# EAGLE design TrinketBlinkM0N (EAGLE 8.4.3)
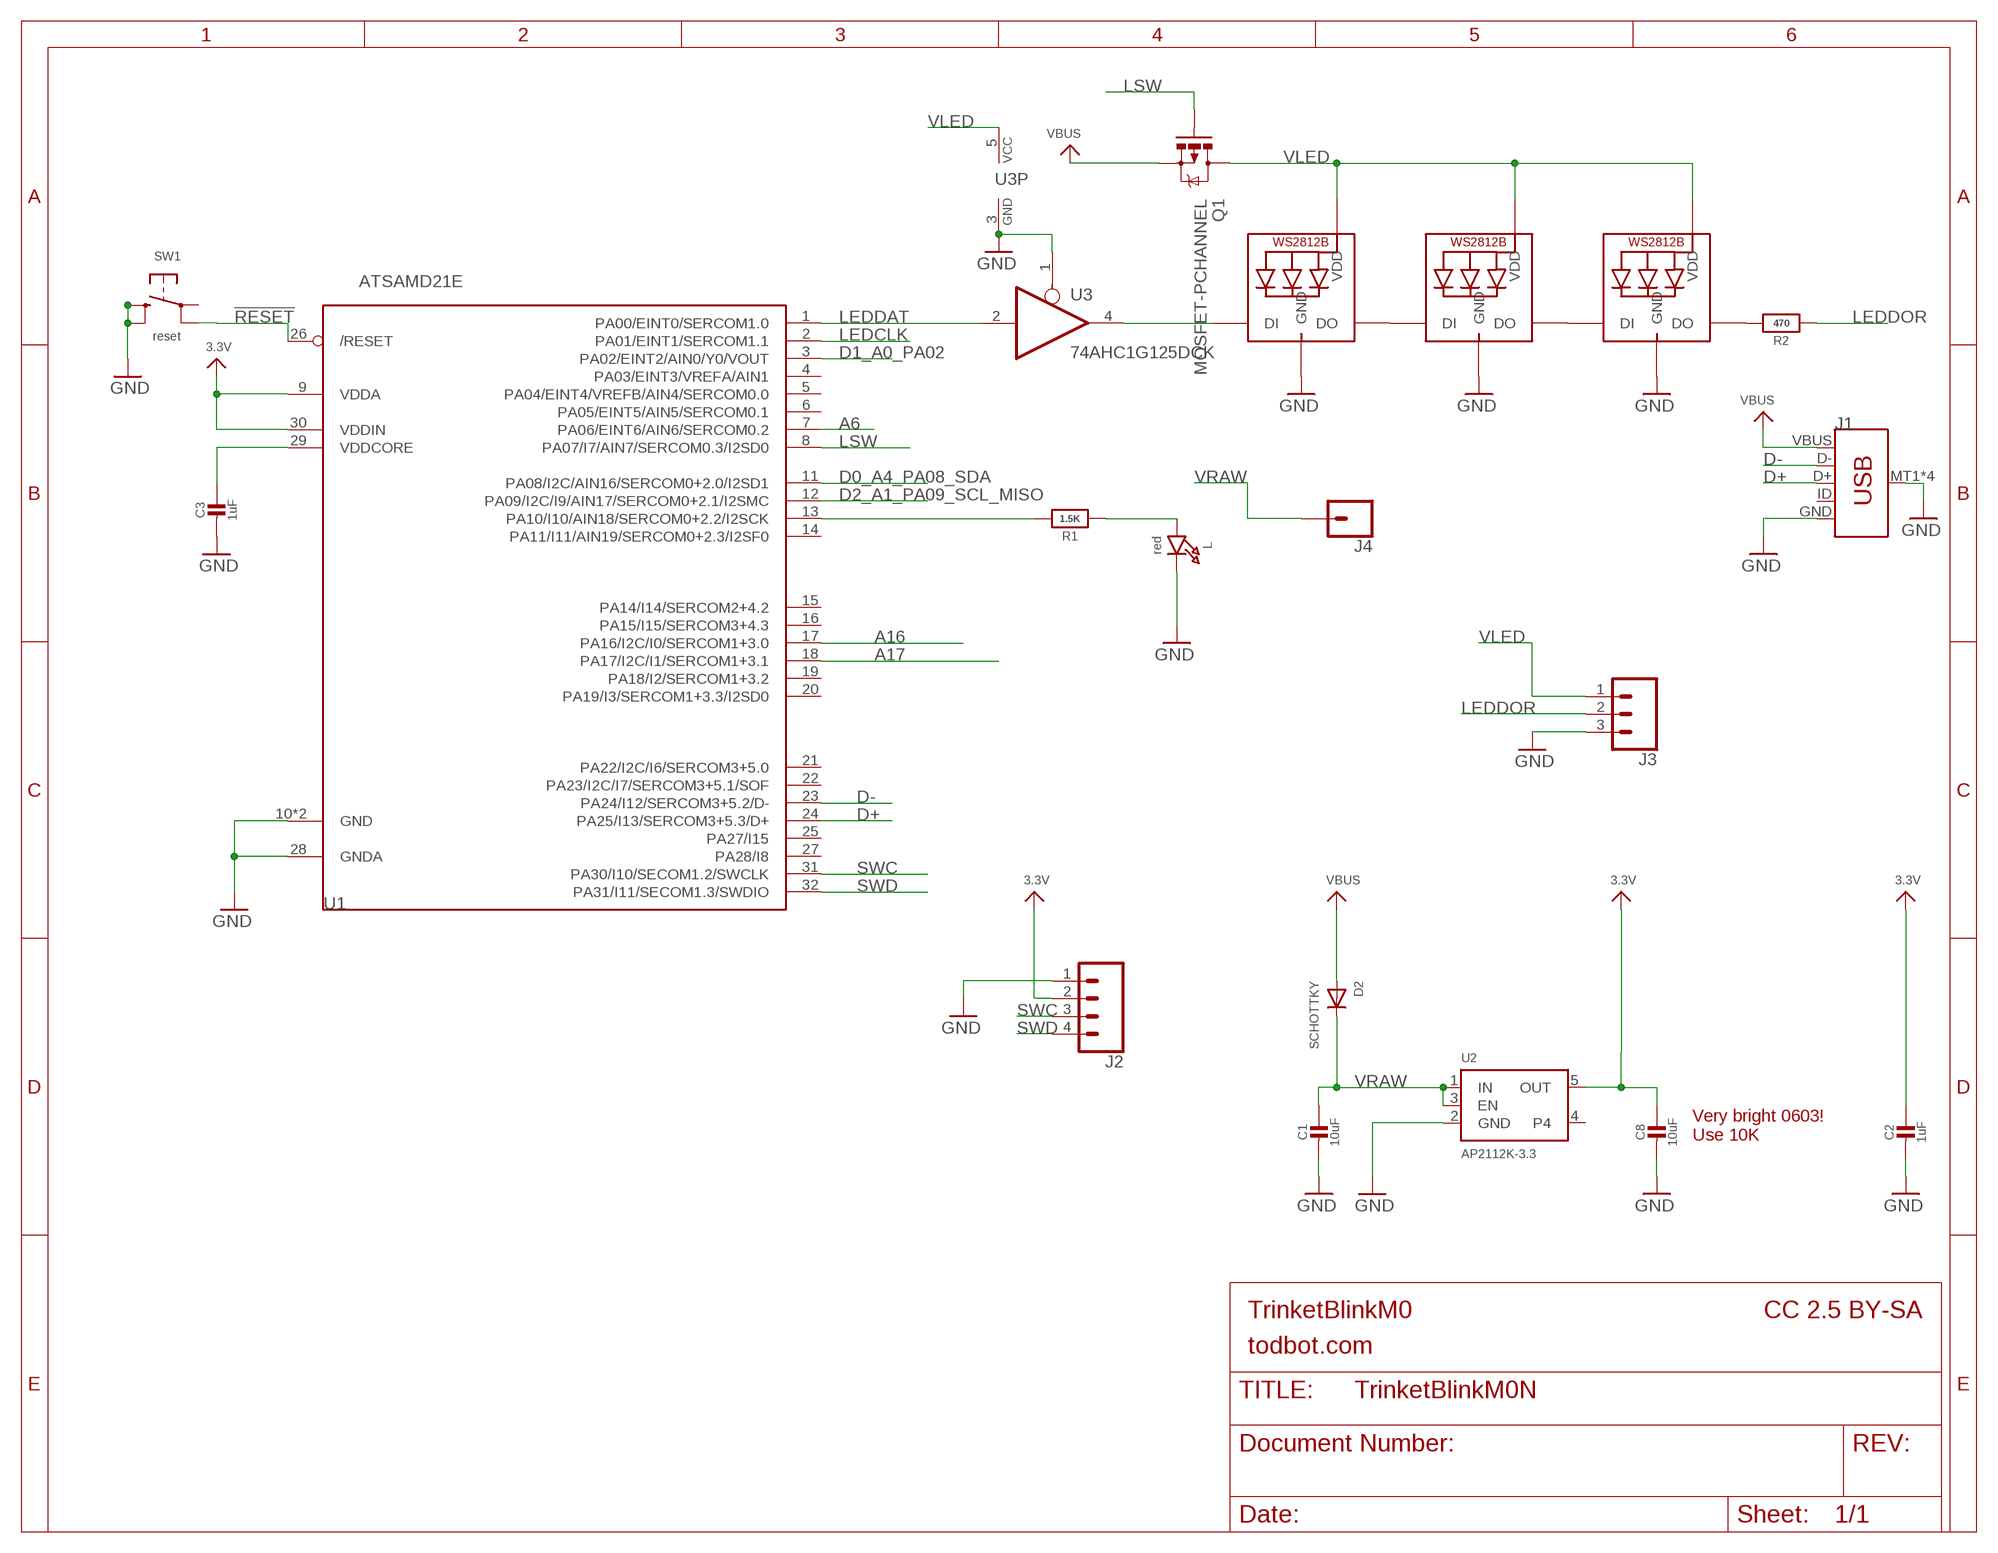
[diagram p0: schematic, sheet 1]

## Parts
C1  10uF  CAP_CERAMIC0805-NOOUTLINE  [0805-NO]
C2  1uF  CAP_CERAMIC0603_NO  [0603-NO]
C3  1uF  CAP_CERAMIC0603_NO  [0603-NO]
C8  10uF  CAP_CERAMIC0805-NOOUTLINE  [0805-NO]
D2  SCHOTTKY  DIODE_SOD-123FL  [SOD-123FL]
J1  USB_MICRO-B_SMT  [USB-MICROB]
J2  CONN_04  [1X04]
J3  CONN_03  [1X03]
J4  CONN_01  [1X01]
L  red  LED0603_NOOUTLINE  [CHIPLED_0603_NOOUTLINE]
LED1  WS2812B3535  [LED3535]
LED2  WS2812B3535  [LED3535]
LED3  WS2812B3535  [LED3535]
Q1  MOSFET-PCHANNEL  [SOT23-3]
R1  1.5K  RESISTOR_0603_NOOUT  [0603-NO]
R2  470  RESISTOR_0603_NOOUT  [0603-NO]
SW1  reset  SWITCH_TACT_SMT4.6X2.8  [BTN_KMR2_4.6X2.8]
U1  ATSAMD21E  [QFN32_5MM]
U2  AP2112K-3.3  VREG_SOT23-5  [SOT23-5]
U3  74AHC1G125DCK  [SC70-5]

## Nets
3.3V: C2.1 C8.1 J2.2 U1.9(VDDA) U1.30(VDDIN) U2.5(OUT)
!RESET: SW1.A'(P1) U1.26(/RESET)
A6: U1.7(PA06/EINT6/AIN6/SERCOM0.2)
A16: U1.17(PA16/I2C/I0/SERCOM1+3.0)
A17: U1.18(PA17/I2C/I1/SERCOM1+3.1)
D0_A4_PA08_SDA: U1.11(PA08/I2C/AIN16/SERCOM0+2.0/I2SD1)
D1_A0_PA02: U1.3(PA02/EINT2/AIN0/Y0/VOUT)
D2_A1_PA09_SCL_MISO: U1.12(PA09/I2C/I9/AIN17/SERCOM0+2.1/I2SMC)
D+: J1.D+ U1.24(PA25/I13/SERCOM3+5.3/D+)
D-: J1.D- U1.23(PA24/I12/SERCOM3+5.2/D-)
GND: C1.2 C2.2 C3.2 C8.2 J1.GND J1.MT1(SHIELD) J1.MT2(SHIELD) J1.P$1(SHIELD) J1.P$2(SHIELD) J2.1 J3.3 L.C LED1.4(GND) LED2.4(GND) LED3.4(GND) SW1.B'(S1) SW1.B(S) U1.10(GND) U1.28(GNDA) U1.33(GND) U2.2(GND) U3.1(OE) U3.3(GND)
LEDCLK: U1.2(PA01/EINT1/SERCOM1.1)
LEDDAT: U1.1(PA00/EINT0/SERCOM1.0) U3.2(I)
LEDDATO: LED1.1(DI) U3.4(O)
LEDDOR: J3.2 R2.1
LSW: Q1.1(G) U1.8(PA07/I7/AIN7/SERCOM0.3/I2SD0)
N$1: L.A R1.1
N$2: R1.2 U1.13(PA10/I10/AIN18/SERCOM0+2.2/I2SCK)
N$4: LED1.3(DO) LED2.1(DI)
N$5: LED2.3(DO) LED3.1(DI)
N$6: LED3.3(DO) R2.2
SWC: J2.3 U1.31(PA30/I10/SECOM1.2/SWCLK)
SWD: J2.4 U1.32(PA31/I11/SECOM1.3/SWDIO)
VBUS: D2.A J1.VBUS Q1.2(S)
VDDCORE: C3.1 U1.29(VDDCORE)
VLED: J3.1 LED1.2(VDD) LED2.2(VDD) LED3.2(VDD) Q1.3(D) U3.5(VCC)
VRAW: C1.1 D2.C J4.1 U2.1(IN) U2.3(EN)
Unconnected: J1.ID SW1.A(P) U1.4(PA03/EINT3/VREFA/AIN1) U1.5(PA04/EINT4/VREFB/AIN4/SERCOM0.0) U1.6(PA05/EINT5/AIN5/SERCOM0.1) U1.14(PA11/I11/AIN19/SERCOM0+2.3/I2SF0) U1.15(PA14/I14/SERCOM2+4.2) U1.16(PA15/I15/SERCOM3+4.3) U1.19(PA18/I2/SERCOM1+3.2) U1.20(PA19/I3/SERCOM1+3.3/I2SD0) U1.21(PA22/I2C/I6/SERCOM3+5.0) U1.22(PA23/I2C/I7/SERCOM3+5.1/SOF) U1.25(PA27/I15) U1.27(PA28/I8) U2.4

## Notes on the sheet
- Very bright 0603!
  Use 10K
- TrinketBlinkM0 | CC 2.5 BY-SA
- todbot.com

## Library data of the parts
C1-C3 C8 = microbuilder:CAP_CERAMIC: Ceramic Capacitors For new designs, use the packages preceded by an '_' character since they are more reliable: The following footprints should be used on most boards: _0402 - Standard footprint for regular board layouts _0603 - Standard footprint for regular board layouts _0805 - Standard footprint for regular board layouts _1206 - Standard footprint for regular board layouts For extremely tight-pitch boards where space is at a premium, the following 'micro-pitch' footprints can be used (smaller pads, no silkscreen outline, etc.): _0402MP - Micro-pitch footprint for very dense/compact boards _0603MP - Micro-pitch footprint for very dense/compact boards _0805MP - Micro-pitch footprint for very dense/compact boards _1206MP - Micro-pitch footprint for very dense/compact boards
D2 = adafruit:DIODE: Diode SMADIODE - SMA Surface Mount Package 20V 1A Schottky Diode Digikey: 641-1014-6-ND DO-1N4148 - Through Hole Small Current Diode SOD-123 20V 1 A (.5mV Vf) Schottky Diode - Digikey: MBRX120TPMSCT-ND SOD-323 10V 570mA (.38mV Vf, 3ns) Schottky Diode - Digikey: ZLLS410CT-ND SOD-523 30V 30mA Schottky Diode (RB751S-40TE61) - Digikey: RB751S-40TE61CT-ND SOT23-R/W - SOT23 Package (R = Solder Paste/Reflow Ovens, W = Hand-Soldering) BAT54Film 40V 300mA - Digikey: 497-7162-1-ND
J1 = SparkFun-Connectors:USB_MICRO-B: USB Type Micro-B Connector Male/female and PTH/SMT variants SparkFun Products: SparkFun microB USB Breakout <https://www.sparkfun.com/products/12035> SparkFun USB microB Plug Breakout <https://www.sparkfun.com/products/10031> SparkFun ESP8266 Thing <https://www.sparkfun.com/products/13231>; PROD_ID: CONN-09505; SF_ID: PRT-08533
J2 = SparkFun-Connectors:CONN_04: Multi connection point. Often used as Generic Header-pin footprint for 0.1 inch spaced/style header connections On any of the 0.1 inch spaced packages, you can populate with these: Break Away Headers - Straight <https://www.sparkfun.com/products/116> (PRT-00116) Break Away Male Headers - Right Angle <https://www.sparkfun.com/products/553> (PRT-00553) Female Headers <https://www.sparkfun.com/products/115> (PRT-00115) Break Away Headers - Machine Pin <https://www.sparkfun.com/products/117> (PRT-00117) Break Away Female Headers - Swiss Machine Pin <https://www.sparkfun.com/products/743> (PRT-00743) For SCREWTERMINALS and SPRING TERMINALS visit here: Screw Terimnals on SparkFun.com <https://www.sparkfun.com/search/results?term=Screw+Terminals> (5mm/3.5mm/2.54mm spacing) This device is also useful as a general connection point to wire up your design to another part of your project. Our various solder wires solder well into these plated through hole pads. Hook-Up Wire - Assortment (Stranded, 22 AWG) <https://www.sparkfun.com/products/11375> (PRT-11375) Hook-Up Wire - Assortment (Solid Core, 22 AWG) <https://www.sparkfun.com/products/11367> (PRT-11367) View the entire wire category on our website here <https://www.sparkfun.com/categories/141> Special notes: Molex polarized connector foot print use with SKU : PRT-08231 with associated crimp pins and housings. 1MM SMD Version SKU: PRT-10208; PROD_ID: CONN-09696
J3 = SparkFun-Connectors:CONN_03: Multi connection point. Often used as Generic Header-pin footprint for 0.1 inch spaced/style header connections On any of the 0.1 inch spaced packages, you can populate with these: Break Away Headers - Straight <https://www.sparkfun.com/products/116> (PRT-00116) Break Away Male Headers - Right Angle <https://www.sparkfun.com/products/553> (PRT-00553) Female Headers <https://www.sparkfun.com/products/115> (PRT-00115) Break Away Headers - Machine Pin <https://www.sparkfun.com/products/117> (PRT-00117) Break Away Female Headers - Swiss Machine Pin <https://www.sparkfun.com/products/743> (PRT-00743) Stackable Header - 3 Pin (Female, 0.1") <https://www.sparkfun.com/products/13875> (PRT-13875) For SCREWTERMINALS and SPRING TERMINALS visit here: Screw Terimnals on SparkFun.com <https://www.sparkfun.com/search/results?term=Screw+Terminals> (5mm/3.5mm/2.54mm spacing) This device is also useful as a general connection point to wire up your design to another part of your project. Our various solder wires solder well into these plated through hole pads. Hook-Up Wire - Assortment (Stranded, 22 AWG) <https://www.sparkfun.com/products/11375> (PRT-11375) Hook-Up Wire - Assortment (Solid Core, 22 AWG) <https://www.sparkfun.com/products/11367> (PRT-11367) View the entire wire category on our website here <https://www.sparkfun.com/categories/141> Special notes: Molex polarized connector foot print use with SKU : PRT-08232 with associated crimp pins and housings.
J4 = SparkFun-Connectors:CONN_01: Single connection point. Often used as Generic Header-pin footprint for 0.1 inch spaced/style header connections On any of the 0.1 inch spaced packages, you can populate with these: Break Away Headers - Straight <https://www.sparkfun.com/products/116> (PRT-00116) Break Away Male Headers - Right Angle <https://www.sparkfun.com/products/553> (PRT-00553) Female Headers <https://www.sparkfun.com/products/115> (PRT-00115) Break Away Headers - Machine Pin <https://www.sparkfun.com/products/117> (PRT-00117) Break Away Female Headers - Swiss Machine Pin <https://www.sparkfun.com/products/743> (PRT-00743) This device is also useful as a general connection point to wire up your design to another part of your project. Our various solder wires solder well into these plated through hole pads. Hook-Up Wire - Assortment (Stranded, 22 AWG) <https://www.sparkfun.com/products/11375> (PRT-11375) Hook-Up Wire - Assortment (Solid Core, 22 AWG) <https://www.sparkfun.com/products/11367> (PRT-11367) View the entire wire category on our website here <https://www.sparkfun.com/categories/141> Special notes: SMTSO-256-ET is a "flush mount" nut for a 4-40 screw. We mostly use this on specialty testbeds; it is a nice way to connect hardware to your PCB at an adjustable hieght. Also note, the SNAP packages are for using a snappable style connector. We sell a baggie of snaps and they are also used on two LilyPad designs: Snap Assortment - 30 pack (male and female) <https://www.sparkfun.com/products/11347> (DEV-11347) LilyPad Arduino SimpleSnap <https://www.sparkfun.com/products/10941> (DEV-10941) LilyPad SimpleSnap Protoboard <https://www.sparkfun.com/products/10940> (DEV-10940)
L = microbuilder:LED: LED 0603 - 0603 Surface Mount Package 2mA: Green LED - Low Power (3.9mcd, 2ma, 1.7Vf) - Digikey: 475-2709-2-ND Orange LED - Low Power (9.8mcd, 2ma, 1.8Vf) - Digikey: 475-1194-2-ND Red LED - Low Power (5mcd, 2ma, 1.8Vf) - Digikey: 475-1195-2-ND Yellow LED - Low Power (7mcd, 2ma, 1.8Vf) - Digikey: 475-1196-2-ND 5mA: Blue LED - Low Power (17mcd, 5ma, 2.9Vf) - Digikey: LNJ937W8CRACT-ND 0805 - 0805 Surface Mount Package 2mA: Red LED (8.8mcd, 2mA, 1.8Vf, Clear) - Low Power [Digikey: 475-2510-1-ND] Green LED (5mcd, 2mA, 1.8Vf, Clear) - Low Power [Digikey: 475-2730-1-ND] Yellow LED (11.3mcd, 2mA, 1.8Vf, Clear) - Low Power [Digikey: 475-2555-1-ND] 20mA: Red LED (104mcd, 20mA, Diffused) - LS R976 [Digikey: 475-1278-6-ND] Red LED (12mcd, 20mA, 2.0Vf, Clear) - APT2012EC [Digikey: 754-1128-1-ND] Green LED (15mcd, 20mA, 2.2Vf, Clear) - APT2012GC [Digikey: 754-1131-1-ND] Orange LED (160mcd, 20mA, 2.1Vf, Clear) - APT2012SECK [Digikey: 754-1130-1-ND] 1206 - 1206 Surface Mount Package Green LED (26mcd, 20mA, Diffused) - LG N971 [Digikey: 475-1407-6-ND] Red LED (15mcd, 20mA, Diffused) - LH N974 [Digikey: 475-1416-6-ND] Cree - Cree High-Power Surface Mount LEDs XPEBWT-L1-0000-00D50 - White 111lm 350mA 2.9Vf 6200K 110° XTEAWT-00-0000-00000LEE3 - White 114lm 350mA 2.85Vf 5000K 115° Everlight - Everlight 45-21 Series Surface Mount LEDs 45-21/QK2C-B2832AC2CB2/2T - Warm White 2000mcd 20mA 3.25Vf 3050K 120° 45-21/LK2C-B38452C4CB2/2T - Nuetral White 2000mcd 20mA 3.25Vf 4150K 120° 45-21/LK2C-B50634C6CB2/2T - Cold White 2200mcd 20mA 3.25Vf 5650K 120° PLCC2 Reverse Mount LS T77K-J1L2-1-0-2-R18-Z - Red 11.25mcd 2mA 1.8Vf 630nm 120° LO T77K-L1M2-24-Z - Orange 19.6mcd 2mA 1.8Vf 606nm 120° LY T77K-K2M1-26-Z - Yellow 15.7mcd 2mA 1.8Vf 587nm 120°
LED1-LED3 = adafruit:WS2812B
Q1 = User-Submitted:MOSFET-PCHANNEL: Generic PMOSFET IRLML2244 - TRANS-11153 (SOT-23 -20V -4.3A) (1.Gate 2.Source 3.Drain) FQP27P06 - COM-10349 <http://www.sparkfun.com/products/10349> (TO-220 -60V -27A) (1.Gate 2.Source 3.Drain); PROD_ID: TRANS-08285
R1 R2 = microbuilder:RESISTOR: Resistors For new designs, use the packages preceded by an '_' character since they are more reliable: The following footprints should be used on most boards: _0402 - Standard footprint for regular board layouts _0603 - Standard footprint for regular board layouts _0805 - Standard footprint for regular board layouts _1206 - Standard footprint for regular board layouts For extremely tight-pitch boards where space is at a premium, the following 'micro-pitch' footprints can be used (smaller pads, no silkscreen outline, etc.): _0402MP - Micro-pitch footprint for very dense/compact boards _0603MP - Micro-pitch footprint for very dense/compact boards _0805MP - Micro-pitch footprint for very dense/compact boards _1206MP - Micro-pitch footprint for very dense/compact boards
SW1 = microbuilder:SWITCH_TACT_SMT: SMT Tact Switches 6x6mm - Digikey: P12940SCT-ND KMR2 (4.6x2.8mm) - Digikey: 401-1426-1-ND EVQ-PQHB55 - Light Touch, 160GF (4.5x4.5mm) - Digikey: P8090SCT-ND KMT0 - KMT021 NGJ LHS (etc.) IP68/Waterproof - Digikey: CKN10289CT-ND
U1 = microbuilder:ATSAMD21E
U2 = microbuilder:VREG_SOT23-5: SOT23-5 Fixed Voltage Regulators Part Current Out V Out V In V Dropout θJA (°C/W) TJ (°C) Digikey Part No. ADP121 150mA 3.3V 3.4-5.5V 0.09V @ 150mA -- -- ADP121-AUJZ33R7CT-ND ADP121 150mA 3.0V 3.1-5.5V 0.09V @ 150mA -- -- ADP121-AUJZ30R7CT-ND ADP122 300mA 3.3V 3.4-5.5V 0.085V @ 300mA -- -- ADP122AUJZ-3.3-R7CT-ND ADP1712 300mA 3.3V 3.5-5.5V 0.17V @ 300mA -- -- ADP1712AUJZ-3.3-R7TR-ND AP7311 (Low Cost) 150mA 3.3V 3.5-6V 0.15V @ 150mA -- -- AP7311-33WG-7DICT-ND LD39015M18R 150mA 1.8V 1.9V-5.5V 0.08V @ 100mA -- -- 497-6977-1-ND LP2985A-33DBVR 150mA 3.3V 3.3-16V 0.28V @ 150mA 206 150 296-18479-1-ND MCP1824T-3302E/OT 300mA 3.3V 3.5V-6V 0.2V @ 300mA -- -- MCP1824T-3302E/OTCT-ND MIC5205-2.5YM5 TR 150mA 2.5V 2.7-16V 0.165V @ 150mA -- -- 576-1257-2-ND MIC5205-3.0YM5 TR 150mA 3.0V 3.2V-16V 0.165V @ 150mA -- -- 576-1258-2-ND MIC5205-3.3YM5 TR 150mA 3.3V 3.5V-16V 0.165V @ 150mA -- -- 576-1259-2-ND TPS780330220 150mA 3.3V+2.2V 3.6-5.5V 250mV Max -- -- 296-23332-1-ND TDA3663/N1,135 100mA 3.3V 3.5-45V 0.18V @ 50mA -- -- 568-5343-1-ND Max operating temp can be calculated using θJA, TJ (max junction temperature), and power in watts. Set the "Maximum Ambient Temperature" until it reaches TJ ("Max Junction Temperature"), which is the absolute limit for safe use of the regulator: Heat Sink Temperature Calculator <http://www.daycounter.com/Calculators/Heat-Sink-Temperature-Calculator.phtml> For example, With 12V source into a 3.3V LP2985 and a 30mA load, we are dissipating (12V-3.3V) * 0.03A = 0.261W. With a θJA of 206 °C/W, a TJ of 150°C, and 261mW we can safely use the chip without a heat sink up to 75°C (=147.1°C Junction Temperature).
U3 = 74xx-little-us:74*1G125: Single Bus Buffer Gate with 3-State Output

## Net classes
1 power: width 0.305 mm

## Board
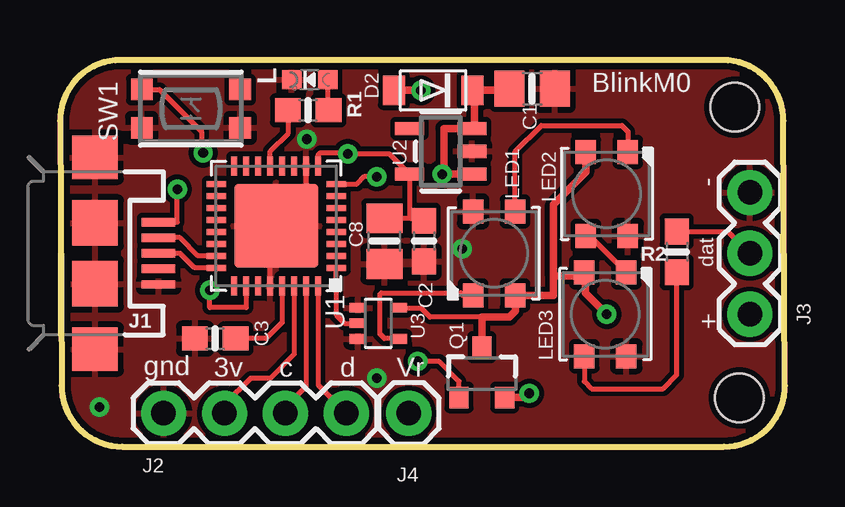
[diagram p1: board, top side]
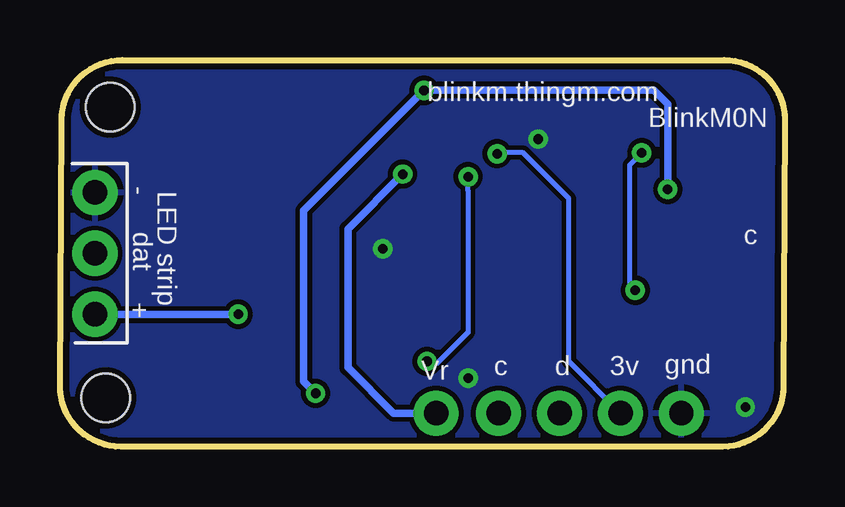
[diagram p2: board, bottom side, seen from below]

Size 30.23 x 16.13 mm. Coordinates in mm from the lower left corner, seen from the top.
Outline: 30.16,13.59 arc90 27.62,16.13 2.54,16.13 arc90 0,13.59 0.06,2.54 arc90 2.6,0 27.69,0 arc90 30.23,2.54 30.16,13.59
Copper layers (1*16): Top 0.035mm / dielectric 1.5mm / Bottom 0.035mm
Design rules "adafruit-2017": minimum track width 8mil, minimum drill 15.5mil, track to track 8mil, track to pad 8mil, pad to pad 8mil, via to via 8mil, smd to smd 8mil, copper to edge 10mil, drill to drill 8mil, minimum pad ring 10mil, minimum via ring 8mil, stop-mask expansion 2mil, vias tented up to drill 20mil, thermal gap 10mil
Holes 2.03 mm at 28.13,14.16 28.32,2.03

### Footprints (pad centres in the part's own frame; a part is rotated, then mirrored left to right if it is on the bottom)
0805-NO = smd 1.24 x 1.5: 1 -0.95,0; 2 0.95,0
0603-NO = smd 1.075 x 1: 1 -0.85,0; 2 0.85,0
SOD-123FL = smd 0.91 x 1.22: A 1.637,0; C -1.637,0
USB-MICROB = smd 1.4 x 0.35: D+ -2.65,0; D- -2.65,-0.65; GND -2.65,1.3; ID -2.65,0.65; VBUS -2.65,-1.3 | smd 1.9 x 1.8: MT1 0,-4; MT2 0,4 | smd 1.9 x 1.9: P$1 0,-1.27; P$2 0,1.27
1X04 = drill 1.016 pad 1.88: 1 0,0; 2 2.54,0; 3 5.08,0; 4 7.62,0
1X03 = drill 1.016 pad 1.88: 1 0,0; 2 2.54,0; 3 5.08,0
1X01 = drill 1.016 pad 1.88: 1 0,0
CHIPLED_0603_NOOUTLINE = smd 0.8 x 0.8: A 0,-0.75; C 0,0.75
LED3535 = smd 1 x 0.85: 1 -1.75,0.875; 2 -1.75,-0.875; 3 1.75,-0.875; 4 1.75,0.875
SOT23-3 = smd 0.8 x 0.9: 1 -0.95,-1; 2 0.95,-1; 3 0,1.1
BTN_KMR2_4.6X2.8 = smd 0.9 x 0.9: A 2.05,0.8; A' -2.05,0.8; B 2.05,-0.8; B' -2.05,-0.8
QFN32_5MM = smd 0.8 x 0.25: 1 -2.5,1.75; 2 -2.5,1.25; 3 -2.5,0.75; 4 -2.5,0.25; 5 -2.5,-0.25; 6 -2.5,-0.75; 7 -2.5,-1.25; 8 -2.5,-1.75; 17 2.5,-1.75; 18 2.5,-1.25; 19 2.5,-0.75; 20 2.5,-0.25; 21 2.5,0.25; 22 2.5,0.75; 23 2.5,1.25; 24 2.5,1.75 | smd 0.25 x 0.8: 9 -1.75,-2.5; 10 -1.25,-2.5; 11 -0.75,-2.5; 12 -0.25,-2.5; 13 0.25,-2.5; 14 0.75,-2.5; 15 1.25,-2.5; 16 1.75,-2.5; 25 1.75,2.5; 26 1.25,2.5; 27 0.75,2.5; 28 0.25,2.5; 29 -0.25,2.5; 30 -0.75,2.5; 31 -1.25,2.5; 32 -1.75,2.5 | smd 3.5 x 3.5: 33 0,0
SOT23-5 = smd 0.55 x 1.2: 1 -0.95,-1.3; 2 0,-1.3; 3 0.95,-1.3; 4 0.95,1.3; 5 -0.95,1.3
SC70-5 = smd 0.4 x 0.7: 1 -0.65,-0.85; 2 0,-0.85; 3 0.65,-0.85; 4 0.65,0.85; 5 -0.65,0.85

### Placement (x,y rotation side)
C1  19.69,14.92 0 top
C2  15.18,8.57 270 top
C3  6.48,4.51 180 top
C8  13.53,8.57 270 top
D2  15.56,14.86 180 top
J1  1.46,8.06 180 top
J2  4.32,1.4 0 top
J3  28.77,5.52 90 top
J4  14.54,1.4 0 top
L  10.41,15.3 90 top
LED1  18.1,8.06 90 top
LED2  22.8,10.54 270 top
LED3  22.73,5.52 270 top
Q1  17.59,3.05 0 top
R1  10.35,14.03 180 top
R2  25.72,8.13 270 top
SW1  5.46,14.1 0 top
U1  9.02,9.21 180 top
U2  15.88,12.32 90 top
U3  13.27,5.14 270 top

### Tracks (layer width: path | path; a pad name or v marks a point on that pad's centre or on a via)
3.3V  (via drill 0.4)
  Top 0.203: U1.30 9.77,3.86 8.76,2.86 7.94,2.86 6.86,1.78 J2.2 | 11.75,12.22 v12,12.22 | U1.9 10.77,12.16 10.86,12.26 11.96,12.26 v12,12.22 | v12,12.22 13.73,12.22 U2.5 14.57,9.55 14.6,9.52 | 14.6,9.52 C8.1 | 14.6,9.52 15.08,9.52 C2.1
  Bottom 0.203: J2.2 9.02,3.56 9.02,10.35 10.92,12.26 11.87,12.26 12,12.13 v12,12.22 12.14,12.22
!RESET  (via drill 0.4)
  Top 0.203: U1.26 7.77,5.8 6.24,5.8 v6.24,6.52 | SW1.A' 4.15,14.9 5.91,13.14 5.91,12.38 5.91,12.26 v5.97,12.26
  Bottom 0.203: 6.17,6.52 v6.24,6.52 6.47,6.75 6.47,11.75 v5.97,12.26
D+
  Top 0.203: U1.24 5.62,7.46 5.01,8.06 J1.D+
D-
  Top 0.203: J1.D- 5,8.71 5.76,7.96 U1.23
GND  (via drill 0.4)
  Top 0.203: 9.02,9.02 8.77,9.02 | 9.02,9.02 U1.33 8.77,9.21 U1.28 | U1.10 10.27,9.02 9.02,9.02
  other vias: 1.65,1.65 10.29,12.83 13.21,2.86 16.76,8.26
  pour Bottom: 30.29,16.32 30.35,-0.13 -0.25,-0.06 -0.32,16.38
  pour Top: -0.32,16.13 -0.25,-0.06 0,-0.06 0,-0.13 30.35,-0.13 30.29,16.13
LEDDAT
  Top 0.203: U3.2 12.32,5.14 11.87,5.14 11.52,5.5 11.52,6.79 | 11.52,6.71 11.52,6.79 | 11.52,6.79 U1.1
LEDDATO
  Top 0.203: U3.4 14.11,4.51 13.53,4.51 13.33,4.7 13.33,6.35 13.4,6.41 16.7,6.41 16.8,6.32 LED1.1
LEDDOR
  Top 0.203: R2.1 27.85,8.98 J3.2
LSW  (via drill 0.4)
  Top 0.203: U1.8 12.38,10.96 12.7,11.28 13.19,11.28 v13.21,11.26 | Q1.1 16.64,2.73 15.82,3.56 v14.92,3.56
  Bottom 0.203: 13.21,10.67 13.21,10.62 | 13.21,10.67 v13.21,11.26 | 13.21,10.67 13.21,4.76 14.48,3.49 14.99,3.49 v14.92,3.56
N$1
  Top 0.203: L.A 11.16,14.13 11.2,14.1 R1.1
N$2
  Top 0.203: U1.13 8.77,12.32 9.52,13.08 9.52,14.01 R1.2
N$4
  Top 0.203: LED2.1 23.69,12.3 23.69,13.14 23.43,13.4 20.07,13.4 18.97,12.3 LED1.3
N$5
  Top 0.203: LED2.3 22.09,8.79 LED3.1
N$6
  Top 0.203: LED3.3 21.86,2.72 22.16,2.41 25.15,2.41 25.72,2.99 R2.2
SWC
  Top 0.203: U1.31 10.27,2.52 9.4,1.65 J2.3
SWD
  Top 0.203: U1.32 10.77,2.57 J2.4
VBUS  (via drill 0.4)
  Top 0.203: v4.89,10.73 4.83,10.73 v4.89,10.73 | J1.VBUS 4.89,9.37 v4.89,10.73 | 13.98,14.86 D2.A
  Top 0.305: 13.98,14.86 v15.05,14.86 | Q1.2 19.39,2.05 v19.57,2.22
  Bottom 0.305: v4.89,10.73 4.89,14.29 5.46,14.86 v15.05,14.86 20.07,9.84 20.07,2.72 v19.57,2.22
VDDCORE
  Top 0.203: C3.1 8.6,4.51 9.27,5.18 U1.29
VLED  (via drill 0.4)
  Top 0.203: U3.5 14.14,5.78 15.05,5.78 15.42,5.41 17.59,5.41 | 18.99,6.3 LED1.2 | 20.57,6.38 20.57,6.32 | LED3.2 21.7,7.11 21.91,6.9 | v22.8,5.52 22.73,5.59
  Top 0.305: 18.99,6.3 18.99,5.65 18.74,5.41 17.59,5.41 Q1.3 | 20.57,6.32 LED1.2 | LED2.2 21.92,11.44 20.57,10.1 20.57,7.11 | 20.57,7.11 20.57,6.38 | 21.7,7.11 20.57,7.11 | 21.91,6.9 21.91,6.41 v22.8,5.52
  Bottom 0.203: 22.73,5.52 v22.8,5.52 22.73,5.52 | 22.73,5.52 22.67,5.59 22.73,5.52
  Bottom 0.305: J3.1 v22.8,5.52
VRAW  (via drill 0.4)
  Top 0.203: 16,11.37 v15.94,11.37 | C1.1 18.67,14.86 | 17.65,13.27 17.27,13.27 U2.3
  Top 0.305: U2.3 16,13.27 16,11.37 U2.1 | 17.27,13.27 17.27,14.86 D2.C 18.74,14.86 C1.1
  Bottom 0.305: J4.1 16.32,1.4 18.22,3.3 18.22,9.08 v15.94,11.37

### Text on the board
tPlace: BlinkM0 | - | dat | + | gnd | 3v | c | d | Vr
bPlace: blinkm.thingm.com | BlinkM0N | LED strip | - | c | dat | + | gnd | 3v | d | c | Vr